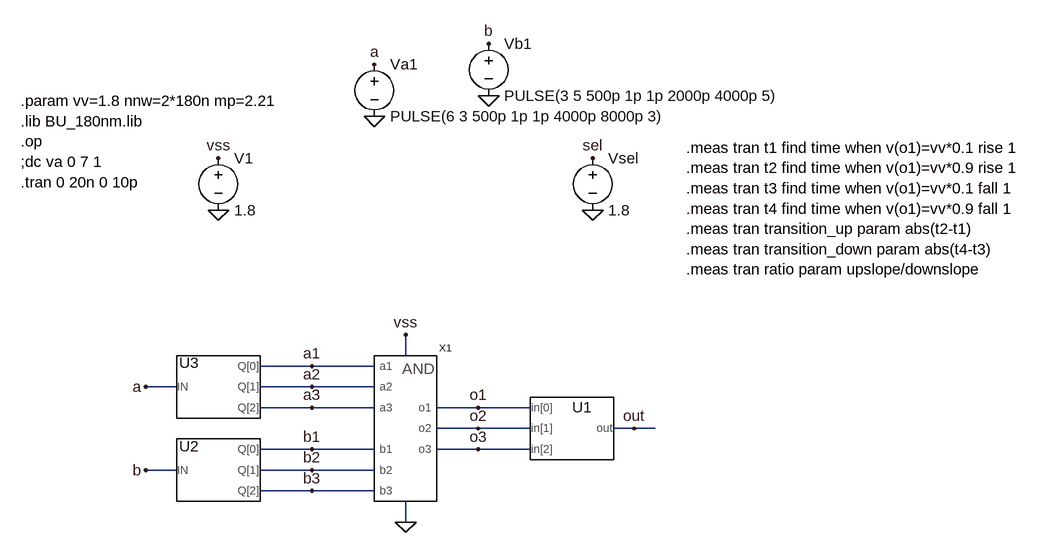
[diagram p0: schematic and3b_test.asc]
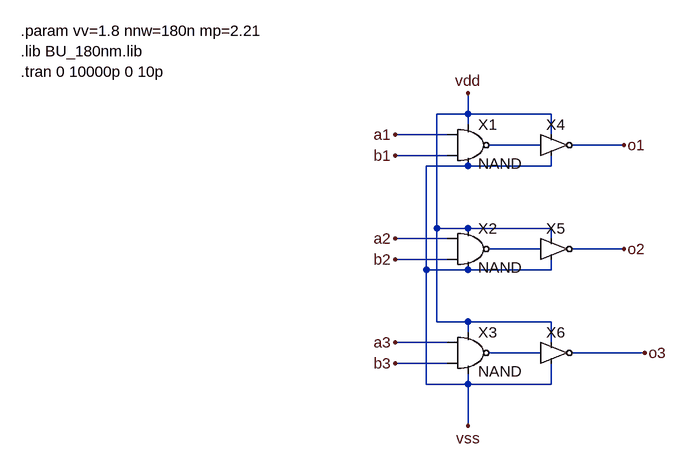
[diagram p1: sub-circuit and3b.asc]
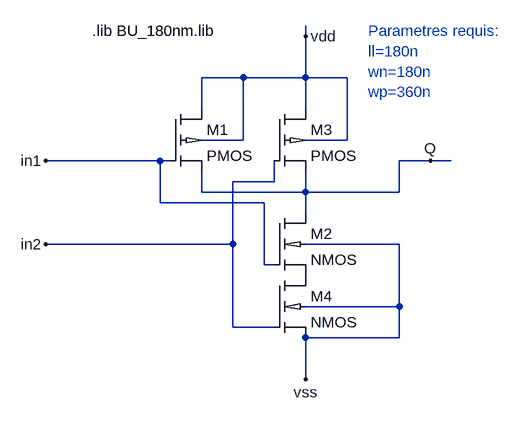
[diagram p2: sub-circuit nand.asc]
and3b_test.asc, the LTspice schematic file:
Version 4
SHEET 1 1448 680
WIRE 432 208 432 176
WIRE 288 224 208 224
WIRE 384 224 288 224
WIRE 80 256 32 256
WIRE 288 256 208 256
WIRE 384 256 288 256
WIRE 288 288 208 288
WIRE 384 288 288 288
WIRE 544 288 480 288
WIRE 624 288 544 288
WIRE 544 320 480 320
WIRE 624 320 544 320
WIRE 784 320 752 320
WIRE 816 320 784 320
WIRE 288 352 208 352
WIRE 384 352 288 352
WIRE 544 352 480 352
WIRE 624 352 544 352
WIRE 80 384 32 384
WIRE 288 384 208 384
WIRE 384 384 288 384
WIRE 288 416 208 416
WIRE 384 416 288 416
WIRE 432 464 432 432
FLAG 784 320 out
FLAG 432 176 vss
FLAG 432 464 0
FLAG 144 -16 0
FLAG 384 -160 0
FLAG 560 -192 0
FLAG 144 -96 vss
FLAG 384 -240 a
FLAG 560 -272 b
FLAG 32 256 a
FLAG 32 384 b
FLAG 720 -16 0
FLAG 720 -96 sel
FLAG 544 288 o1
FLAG 544 320 o2
FLAG 544 352 o3
FLAG 288 224 a1
FLAG 288 256 a2
FLAG 288 288 a3
FLAG 288 352 b1
FLAG 288 384 b2
FLAG 288 416 b3
SYMBOL Bin2Dec 688 320 R0
SYMATTR InstName U1
SYMATTR SpiceLine Vhigh={vv}
SYMBOL Dec2Bin 144 384 R0
SYMATTR InstName U2
SYMATTR SpiceLine Vhigh={vv}
SYMBOL Dec2Bin 144 256 R0
SYMATTR InstName U3
SYMATTR SpiceLine Vhigh={vv}
SYMBOL /voltage 144 -112 R0
SYMATTR InstName V1
SYMATTR Value 1.8
SYMBOL /voltage 720 -112 R0
SYMATTR InstName Vsel
SYMATTR Value 1.8
SYMBOL and3b 432 320 R0
SYMATTR InstName X1
SYMBOL /voltage 384 -256 R0
SYMATTR InstName Va1
SYMATTR Value PULSE(6 3 500p 1p 1p 4000p 8000p 3)
SYMBOL /voltage 560 -288 R0
SYMATTR InstName Vb1
SYMATTR Value PULSE(3 5 500p 1p 1p 2000p 4000p 5)
TEXT -160 -184 Left 2 !.param vv=1.8 nnw=2*180n mp=2.21\n.lib BU_180nm.lib\n.op\n;dc va 0 7 1\n.tran 0 20n 0 10p
TEXT 864 -112 Left 2 !.meas tran t1 find time when v(o1)=vv*0.1 rise 1\n.meas tran t2 find time when v(o1)=vv*0.9 rise 1\n.meas tran t3 find time when v(o1)=vv*0.1 fall 1\n.meas tran t4 find time when v(o1)=vv*0.9 fall 1\n.meas tran transition_up param abs(t2-t1)\n.meas tran transition_down param abs(t4-t3)\n.meas tran ratio param upslope/downslope

and3b.asc, the sub-circuit schematic file:
Version 4
SHEET 1 880 1032
WIRE 0 144 0 112
WIRE 0 144 -48 144
WIRE 128 144 0 144
WIRE 0 160 0 144
WIRE -32 176 -112 176
WIRE 128 176 128 144
WIRE 112 192 32 192
WIRE 240 192 160 192
WIRE -32 208 -112 208
WIRE 0 224 -64 224
WIRE 128 224 128 208
WIRE 128 224 0 224
WIRE -48 320 -48 144
WIRE 0 320 -48 320
WIRE 128 320 0 320
WIRE -32 336 -112 336
WIRE 128 336 128 320
WIRE 112 352 32 352
WIRE 240 352 160 352
WIRE -32 368 -112 368
WIRE -64 384 -64 224
WIRE 0 384 -64 384
WIRE 128 384 128 368
WIRE 128 384 0 384
WIRE -48 464 -48 320
WIRE 0 464 -48 464
WIRE 128 464 0 464
WIRE 0 480 0 464
WIRE -32 496 -112 496
WIRE 128 496 128 464
WIRE 112 512 32 512
WIRE 272 512 160 512
WIRE -32 528 -112 528
WIRE -64 560 -64 384
WIRE 0 560 0 544
WIRE 0 560 -64 560
WIRE 128 560 128 528
WIRE 128 560 0 560
WIRE 0 624 0 560
FLAG 0 112 vdd
FLAG 240 192 o1
FLAG 240 352 o2
FLAG 272 512 o3
FLAG -112 176 a1
FLAG -112 336 a2
FLAG -112 496 a3
FLAG -112 208 b1
FLAG -112 368 b2
FLAG -112 528 b3
FLAG 0 624 vss
SYMBOL nand 0 192 R0
SYMATTR InstName X1
SYMATTR SpiceLine ll=180n wn={2*nnw} wp={nnw*mp/2}
SYMBOL nand 0 352 R0
SYMATTR InstName X2
SYMATTR SpiceLine ll=180n wn={2*nnw} wp={nnw*mp/2}
SYMBOL nand 0 512 R0
SYMATTR InstName X3
SYMATTR SpiceLine ll=180n wn={2*nnw} wp={nnw*mp/2}
SYMBOL inv 128 192 R0
SYMATTR InstName X4
SYMATTR SpiceLine ll=180n wn={nnw} wp={nnw*mp}
SYMBOL inv 128 352 R0
SYMATTR InstName X5
SYMATTR SpiceLine ll=180n wn={nnw} wp={nnw*mp}
SYMBOL inv 128 512 R0
SYMATTR InstName X6
SYMATTR SpiceLine ll=180n wn={nnw} wp={nnw*mp}
TEXT -688 16 Left 2 !.param vv=1.8 nnw=180n mp=2.21\n.lib BU_180nm.lib\n.tran 0 10000p 0 10p

nand.asc, the sub-circuit schematic file:
Version 4
SHEET 1 1192 788
WIRE 448 176 448 160
WIRE 352 240 288 240
WIRE 448 240 448 176
WIRE 448 240 352 240
WIRE 512 240 448 240
WIRE 288 288 288 240
WIRE 448 288 448 240
WIRE 352 336 352 240
WIRE 352 336 288 336
WIRE 512 336 512 240
WIRE 512 336 448 336
WIRE 224 368 48 368
WIRE 240 368 224 368
WIRE 640 368 592 368
WIRE 672 368 640 368
WIRE 400 400 400 368
WIRE 400 400 336 400
WIRE 288 416 288 384
WIRE 448 416 448 384
WIRE 448 416 288 416
WIRE 592 416 592 368
WIRE 592 416 448 416
WIRE 224 432 224 368
WIRE 384 432 224 432
WIRE 448 448 448 416
WIRE 336 496 336 400
WIRE 336 496 48 496
WIRE 592 496 448 496
WIRE 384 528 384 432
WIRE 400 528 384 528
WIRE 592 592 592 496
WIRE 592 592 448 592
WIRE 336 624 336 496
WIRE 400 624 336 624
WIRE 592 640 592 592
WIRE 592 640 448 640
WIRE 448 704 448 640
FLAG 448 176 vdd
FLAG 448 704 vss
FLAG 640 368 Q
FLAG 48 368 in1
FLAG 48 496 in2
SYMBOL pmos018 240 288 R0
SYMATTR InstName M1
SYMATTR Value2 l={ll} w={wp} ad={450n*{wp}} as={450n*{wp}} pd={900n+{wp}} ps={1080n+{wp}}
SYMBOL nmos018 400 448 R0
SYMATTR InstName M2
SYMATTR Value2 l={ll} w={wn} ad={450n*{wn}} as={450n*{wn}} pd={900n+{wn}} ps={1080n+{wn}}
SYMBOL pmos018 400 288 R0
SYMATTR InstName M3
SYMATTR Value2 l={ll} w={wp} ad={450n*{wp}} as={450n*{wp}} pd={900n+{wp}} ps={1080n+{wp}}
SYMBOL nmos018 400 544 R0
SYMATTR InstName M4
SYMATTR Value2 l={ll} w={wn} ad={450n*{wn}} as={450n*{wn}} pd={900n+{wn}} ps={1080n+{wn}}
TEXT 120 168 Left 2 !.lib BU_180nm.lib
TEXT 544 168 Left 2 ;Parametres requis: \nll=180n\nwn=180n \nwp=360n

The netlist it stands for:
* and3b_test.asc
XU1 o1 o2 o3 out Bin2Dec Vhigh={vv}  ; pins in[0] in[1] in[2] out
XU2 b b1 b2 b3 Dec2Bin Vhigh={vv}  ; pins IN Q[0] Q[1] Q[2]
XU3 a a1 a2 a3 Dec2Bin Vhigh={vv}  ; pins IN Q[0] Q[1] Q[2]
V1 vss 0 1.8
Vsel sel 0 1.8
XX1 vss a1 a2 a3 b1 b2 b3 0 o1 o2 o3 and3b
Va1 a 0 PULSE(6 3 500p 1p 1p 4000p 8000p 3)
Vb1 b 0 PULSE(3 5 500p 1p 1p 2000p 4000p 5)

* block symbol definitions
.subckt and3b vdd a1 a2 a3 b1 b2 b3 vss o1 o2 o3
XX1 a1 N001 vdd vss b1 nand params: NAND ll=180n wn={2*nnw} wp={nnw*mp/2}
XX2 a2 N002 vdd vss b2 nand params: NAND ll=180n wn={2*nnw} wp={nnw*mp/2}
XX3 a3 N003 vdd vss b3 nand params: NAND ll=180n wn={2*nnw} wp={nnw*mp/2}
XX4 N001 o1 vdd vss inv ll=180n wn={nnw} wp={nnw*mp}  ; pins In _Q vdd vss
XX5 N002 o2 vdd vss inv ll=180n wn={nnw} wp={nnw*mp}  ; pins In _Q vdd vss
XX6 N003 o3 vdd vss inv ll=180n wn={nnw} wp={nnw*mp}  ; pins In _Q vdd vss
.param vv=1.8 nnw=180n mp=2.21
.lib BU_180nm.lib
.tran 0 10000p 0 10p
.ends and3b

.subckt nand in1 Q vdd vss in2
M1 vdd in1 Q vdd PMOS l={ll} w={wp} ad={450n*{wp}} as={450n*{wp}} pd={900n+{wp}} ps={1080n+{wp}}
M2 Q in1 P001 vss NMOS l={ll} w={wn} ad={450n*{wn}} as={450n*{wn}} pd={900n+{wn}} ps={1080n+{wn}}
M3 vdd in2 Q vdd PMOS l={ll} w={wp} ad={450n*{wp}} as={450n*{wp}} pd={900n+{wp}} ps={1080n+{wp}}
M4 P001 in2 vss vss NMOS l={ll} w={wn} ad={450n*{wn}} as={450n*{wn}} pd={900n+{wn}} ps={1080n+{wn}}
.lib BU_180nm.lib
* Parametres requis:
* ll=180n
* wn=180n
* wp=360n
.ends nand

.model NMOS NMOS
.model PMOS PMOS
.lib standard.mos
.param vv=1.8 nnw=2*180n mp=2.21
.lib BU_180nm.lib
.op
;dc va 0 7 1
.tran 0 20n 0 10p
.meas tran t1 find time when v(o1)=vv*0.1 rise 1
.meas tran t2 find time when v(o1)=vv*0.9 rise 1
.meas tran t3 find time when v(o1)=vv*0.1 fall 1
.meas tran t4 find time when v(o1)=vv*0.9 fall 1
.meas tran transition_up param abs(t2-t1)
.meas tran transition_down param abs(t4-t3)
.meas tran ratio param upslope/downslope
.lib Bin2Dec.sub
.lib Dec2Bin.sub
.lib and3b.asc
.lib BU_180nm.lib
.backanno
.end

* Results of the author's LTspice run, read from the files saved beside the schematic
* Operating Point, zero values left out:
*   V(out) = 2 V
*   V(o1) = 1.237 µV
*   V(o2) = 1.8 V
*   V(o3) = 1.237 µV
*   V(b) = 3 V
*   V(b1) = 1.8 V
*   V(b2) = 1.8 V
*   V(a) = 6 V
*   V(a2) = 1.8 V
*   V(a3) = 1.8 V
*   V(vss) = 1.8 V
*   V(sel) = 1.8 V
*   I(Vb1) = -300 A
*   I(Va1) = -600 A
*   I(V1) = -1.688 nA
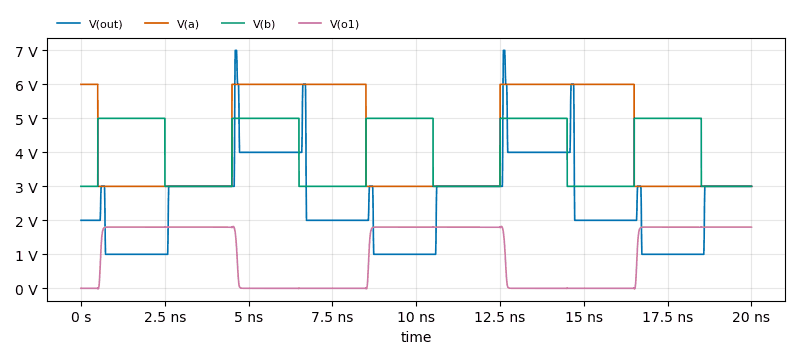
[diagram p3: Transient Analysis of and3b_test.asc, plotted from the saved traces]
* Transient Analysis, 1 run:
*   V(out): min 1 V, max 7 V, average 2.487 V, rms 2.775 V, last 3 V
*   V(a): min 3 V, max 6 V, average 4.275 V, rms 4.525 V, last 3 V
*   V(b): min 3 V, max 5 V, average 4.001 V, rms 4.124 V, last 3 V
*   V(o1): min -15.06 mV, max 1.819 V, average 1.039 V, rms 1.362 V, last 1.8 V
* From the log:
*   t1: time=5.47039e-010 at 5.47039e-010
*   t2: time=6.32831e-010 at 6.32831e-010
*   t3: time=4.7032e-009 at 4.7032e-009
*   t4: time=4.60341e-009 at 4.60341e-009
*   transition_up: abs(t2-t1)=8.57923e-011
*   transition_down: abs(t4-t3)=9.97839e-011
*   Measurement "ratio" FAIL'ed